# EAGLE design rpi-lirc (EAGLE 9.6.2)
Raspberry Pi (RPi) Linux Infrared Remote Control (LIRC)
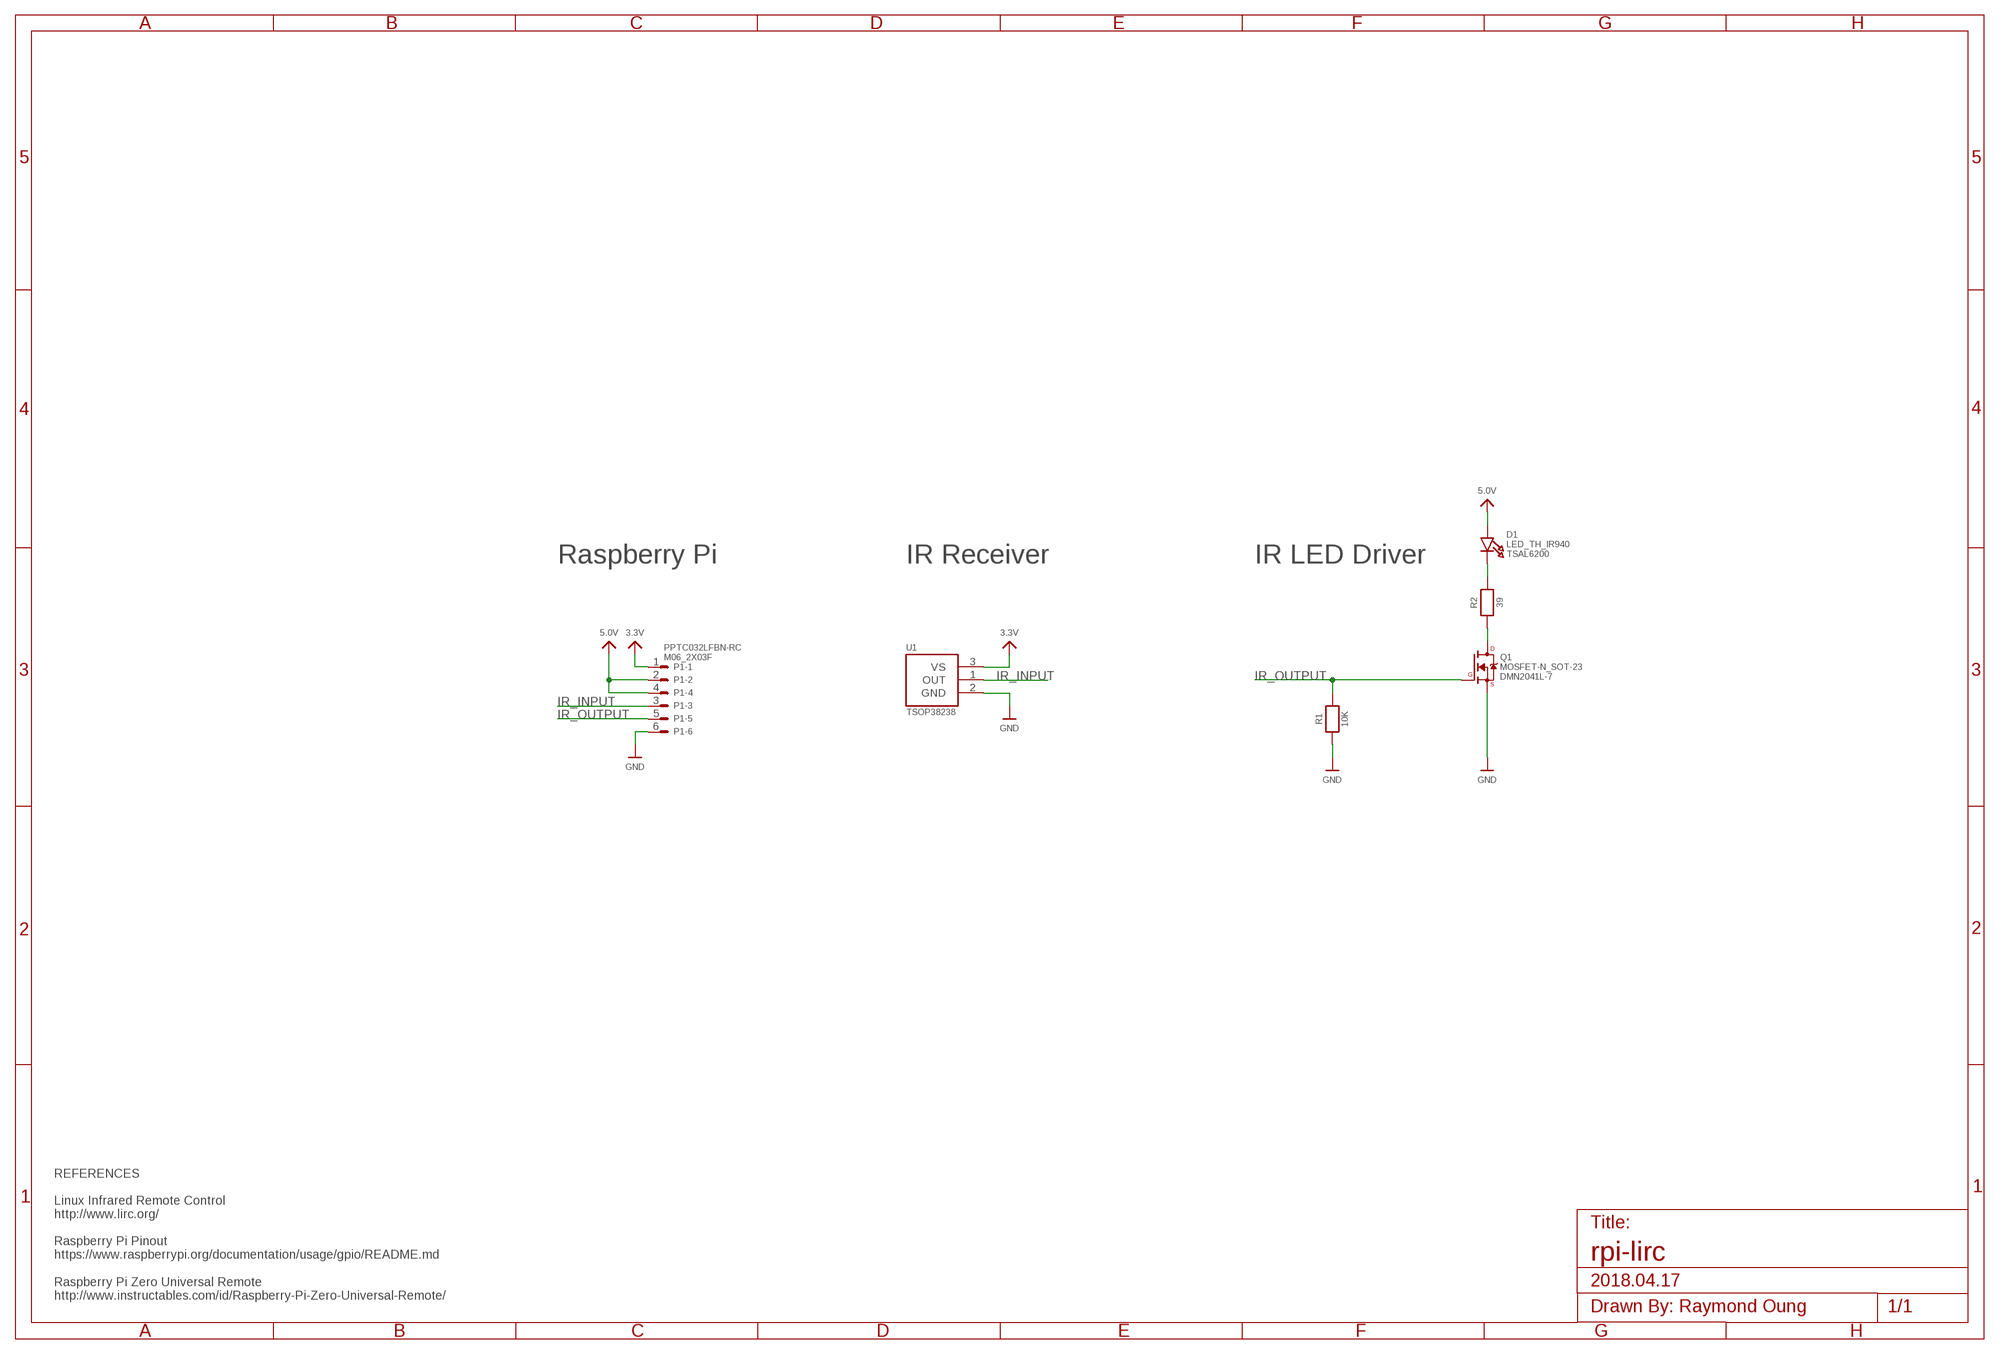
[diagram p0: schematic, sheet 1]

## Parts
D1  LED_TH_IR940  [RADIAL_5MM]
P1  M06_2X03F  [2X03_LOCK]
Q1  MOSFET-N_SOT-23  [SOT23-3]
R1  10K  RESISTOR_0603_10K  [0603]
R2  39  RESISTOR_0603  [0603]
U1  TSOP38238  [TSOP38238]

## Nets
3.3V: P1.1 U1.3(VS)
5.0V: D1.A P1.2 P1.4
GND: P1.6 Q1.2(S) R1.1 U1.2(GND)
IR_INPUT: P1.3 U1.1(OUT)
IR_OUTPUT: P1.5 Q1.1(G) R1.2
N$1: D1.C R2.2
N$2: Q1.3(D) R2.1

## Notes on the sheet
- Raspberry Pi | IR Receiver | IR LED Driver
- 2018.04.17
- REFERENCES
  
  Linux Infrared Remote Control
  http://www.lirc.org/
  
  Raspberry Pi Pinout
  https://www.raspberrypi.org/documentation/usage/gpio/README.md
  
  Raspberry Pi Zero Universal Remote
  http://www.instructables.com/id/Raspberry-Pi-Zero-Universal-Remote/

## Library data of the parts
D1 = roung_led:LED_TH: Light Emitting Diode, through-hole with 5 mm diameter.; DIGIKEY: 751-1204-ND; PARTID: TSAL6200
P1 = roung_connectors:M06: 6-Way Connector; DIGIKEY: S7071-ND; PARTID: PPTC032LFBN-RC
Q1 = roung_transistors:MOSFET-N: N-Channel MOSFET - SOT-23, Vgs_th = 1.2 V; DIGIKEY: DMN2041L-7DICT-ND; PARTID: DMN2041L-7
R1 = roung_rlc:RESISTOR_0603: Resistor; DIGIKEY: A126331CT-ND; PARTID: CRG0603J10K
R2 = roung_rlc:RESISTOR: Resistor
U1 = roung_ic_sensors:TSOP38238: IR Receiver 38kHz Dome Radial; DIGIKEY: 751-1227-ND; PARTID: TSOP38238

## Net classes
0 default: width 0.305 mm, drill 0.305 mm, clearance 0.203 mm

## Board
Raspberry Pi (RPi) Linux Infrared Remote Control (LIRC)
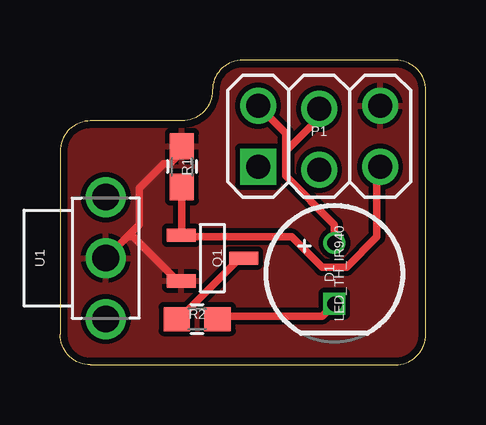
[diagram p1: board, top side]
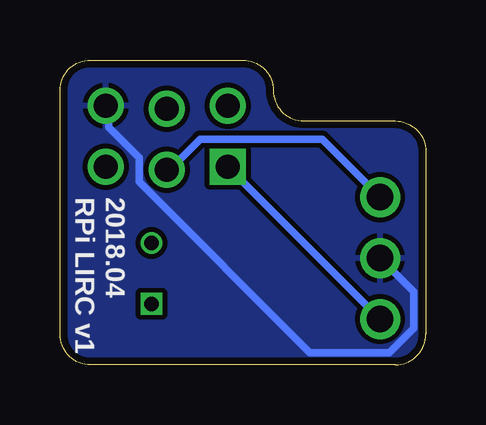
[diagram p2: board, bottom side, seen from below]

Size 15.24 x 12.7 mm. Coordinates in mm from the lower left corner, seen from the top.
Outline: 15.24,1.27 15.24,11.43 arc90 13.97,12.7 7.62,12.7 arc90 6.35,11.43 arc-90 5.08,10.16 1.27,10.16 arc90 0,8.89 0,1.27 arc90 1.27,0 13.97,0 arc90 15.24,1.27
Copper layers (1*16): Top 0.035mm / dielectric 1.6mm / Bottom 0.035mm
Design rules "ITEADstudio-2layer": minimum track width 8mil, minimum drill 12mil, track to track 8mil, track to pad 8mil, pad to pad 8mil, via to via 8mil, smd to smd 0mil, copper to edge 12mil, drill to drill 10mil, minimum pad ring 6mil, minimum via ring 6mil, stop-mask expansion 2mil, vias tented up to drill 100mil, thermal gap 8mil

### Footprints (pad centres in the part's own frame; a part is rotated, then mirrored left to right if it is on the bottom)
RADIAL_5MM = drill 0.6: A 1.27,0 | drill 0.6 square: C -1.27,0
2X03_LOCK = drill 1 square: 1 -2.54,-1.27 | drill 1: 2 -2.54,1.27; 3 0,-1.397; 4 0,1.143; 5 2.54,-1.27; 6 2.54,1.27
SOT23-3 = smd 0.55 x 1.2: 1 -0.95,-1.3; 2 0.95,-1.3; 3 0,1.3
0603 = smd 1.1 x 1: 1 -0.85,0; 2 0.85,0
TSOP38238 = drill 1.11: 1 2.54,0; 2 0,0; 3 -2.54,0

### Placement (x,y rotation side)
D1  11.43,3.81 90 top
P1  10.79,9.53 0 top
Q1  6.35,4.45 270 top
R1  5.08,8.26 270 top
R2  5.71,1.91 0 top
U1  1.91,4.45 90 top

### Tracks (layer width: path | path; a pad name or v marks a point on that pad's centre or on a via)
3.3V
  Bottom 0.305: U1.3 P1.1
5.0V
  Top 0.305: D1.A 11.43,5.84 9.4,7.87 9.4,8.89 | 9.4,8.89 9.4,9.65 P1.2 | 9.4,8.89 10.67,10.16 10.67,10.67 P1.4
GND
  Top 0.305: U1.2 2.79,5.33 | 2.79,5.33 3.3,5.84 3.3,7.37 4.32,8.38 4.57,8.38 5.08,8.89 R1.1 | 2.79,5.33 3.05,5.33 4.83,3.56 Q1.2
  Bottom 0.305: U1.2 0.51,3.05 0.51,1.52 1.52,0.51 4.83,0.51 11.94,7.62 11.94,8.64 13.21,9.91 13.21,10.67 P1.6
  pour Bottom: 0,0 15.24,0 15.24,12.7 0,12.7
  pour Top: 0,0 15.24,0 15.24,12.7 0,12.7
IR_INPUT
  Bottom 0.305: U1.1 4.32,9.4 9.4,9.4 10.67,8.13 P1.3
IR_OUTPUT
  Top 0.305: R1.2 5.08,5.59 Q1.1 5.08,5.33 9.65,5.33 10.92,4.06 11.94,4.06 13.21,5.33 13.21,8.13 P1.5
N$1
  Top 0.305: D1.C 10.92,2.03 6.6,2.03 R2.2
N$2
  Top 0.305: R2.1 5.08,2.03 7.62,4.57 Q1.3

### Text on the board
bPlace: 2018.04 | RPi LIRC v1